# Altium project PCB_Project1.PrjPCB
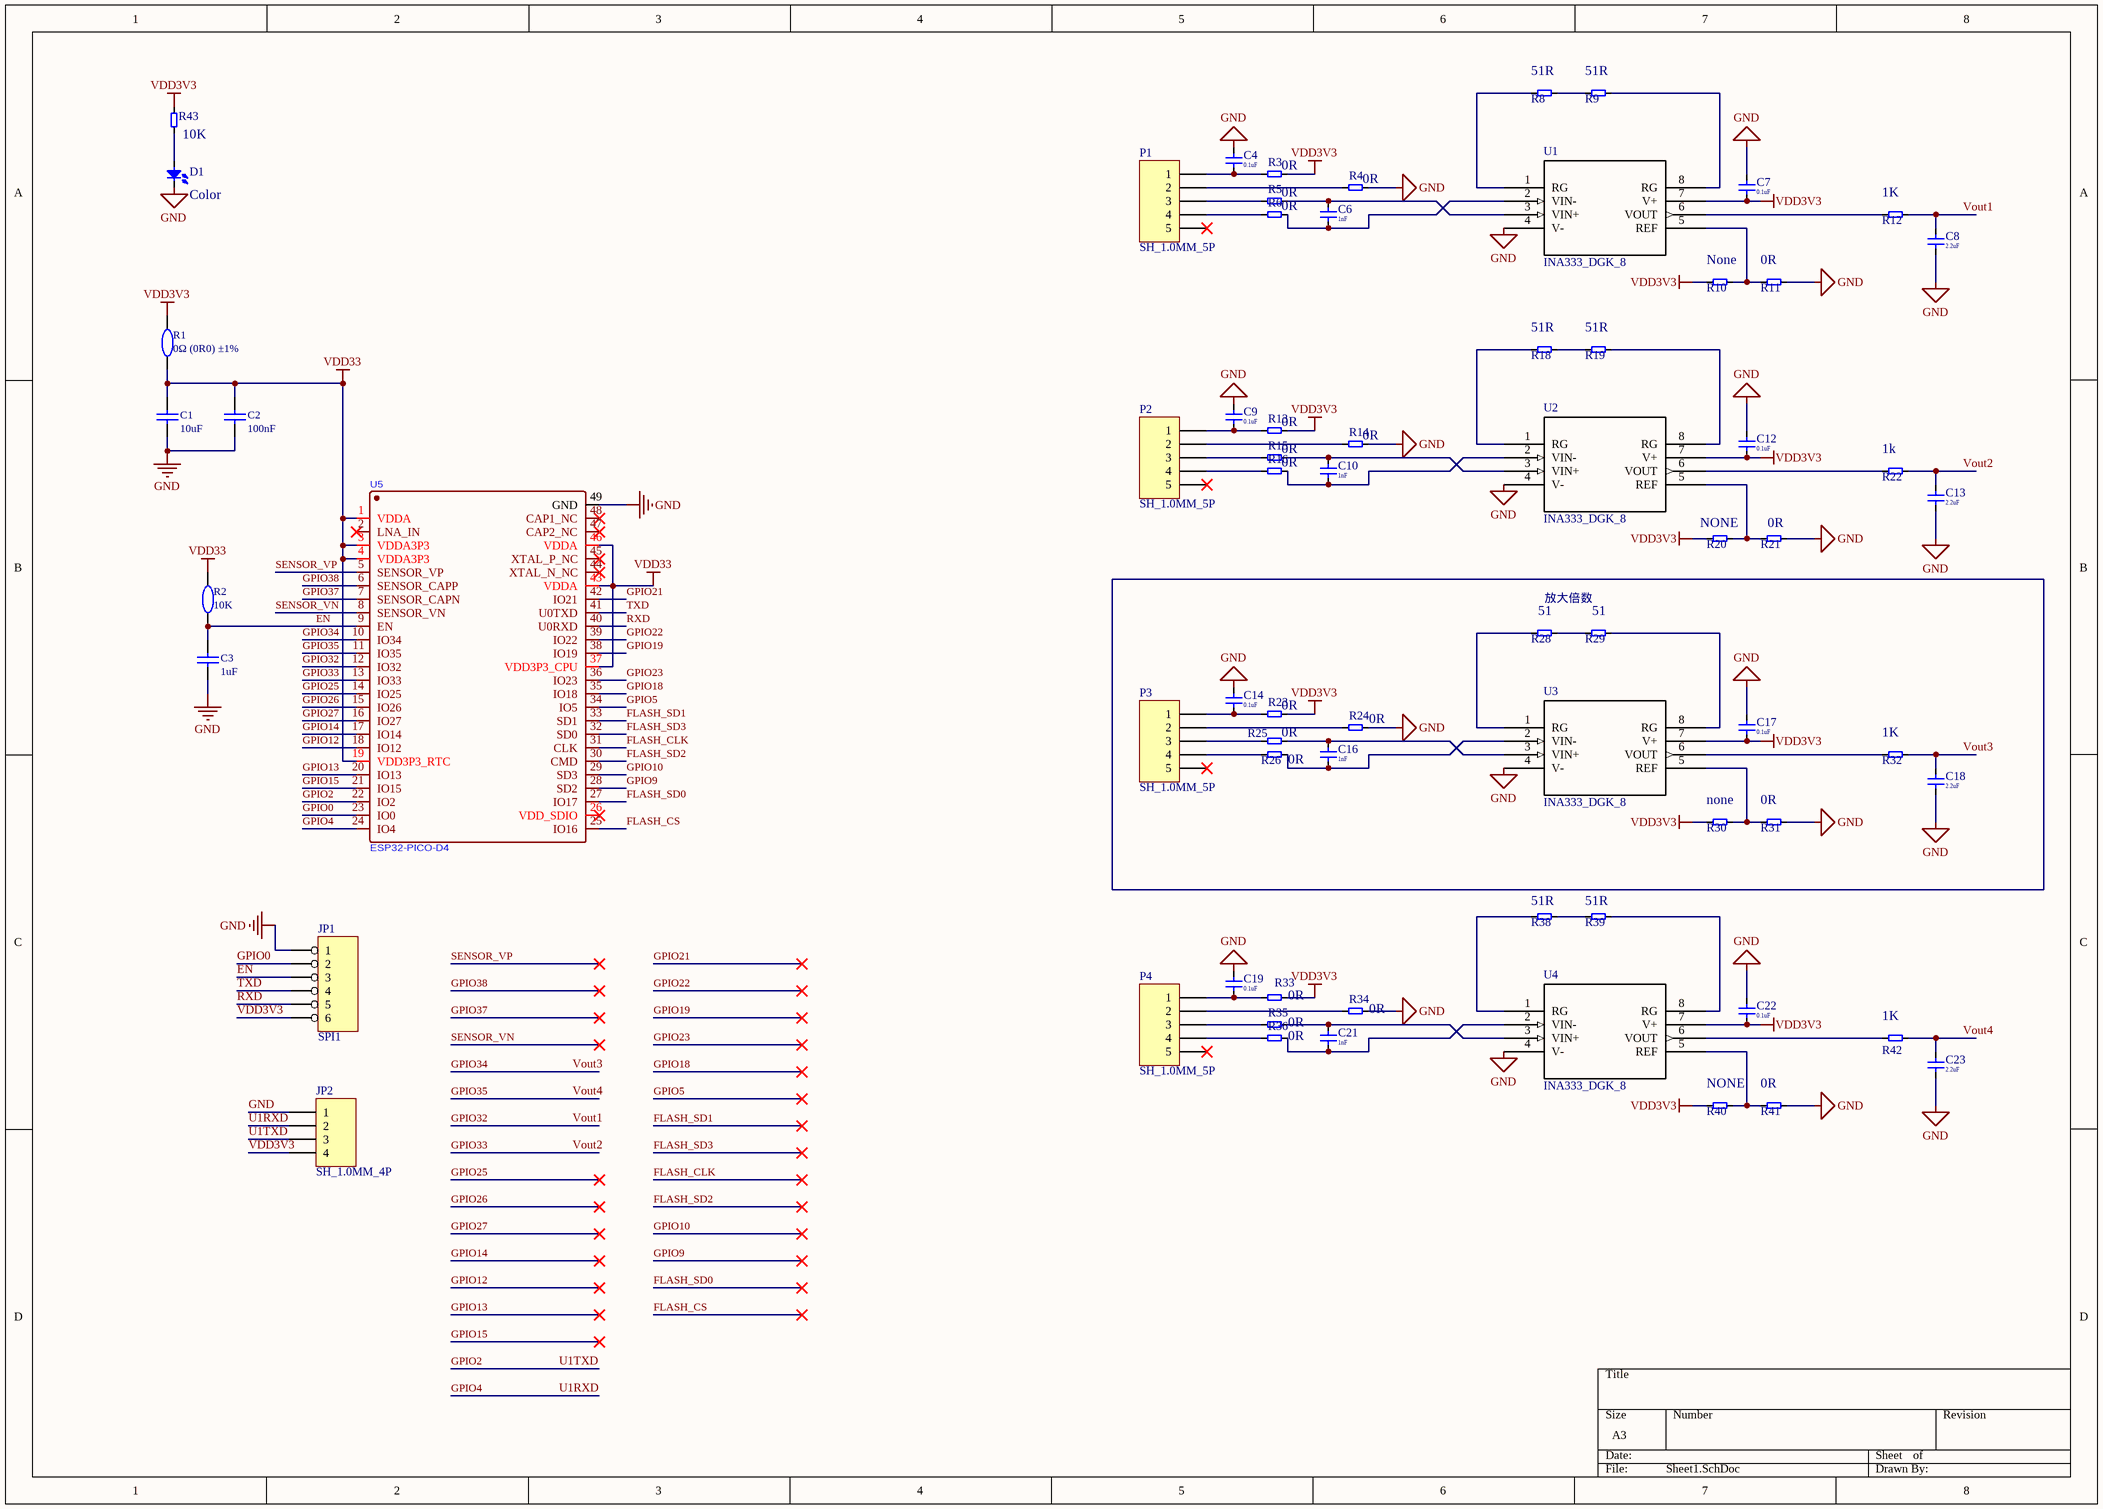
[diagram p0: Sheet1.SchDoc]
1 sheet, 70 parts. Net scope: global (net labels, ports and power ports of the same name join across sheets).
Board file: PCB1.PcbDoc

## Sheet Sheet1.SchDoc
size A3

### Parts
C1  10uF  [0603C]
C2  100nF  [0603C]
C3  1uF  [0603C]
C4  value 0.1uF  [0603C]  (hidden comment: Cb)
C6  value 1nF  [0603C]  (hidden comment: Cb)
C7  value 0.1uF  [0603C]  (hidden comment: Cb)
C8  value 2.2uF  [0603C]  (hidden comment: Cb)
C9  value 0.1uF  [0603C]  (hidden comment: Cb)
C10  value 1nF  [0603C]  (hidden comment: Cb)
C12  value 0.1uF  [0603C]  (hidden comment: Cb)
C13  value 2.2uF  [0603C]  (hidden comment: Cb)
C14  value 0.1uF  [0603C]  (hidden comment: Cb)
C16  value 1nF  [0603C]  (hidden comment: Cb)
C17  value 0.1uF  [0603C]  (hidden comment: Cb)
C18  value 2.2uF  [0603C]  (hidden comment: Cb)
C19  value 0.1uF  [0603C]  (hidden comment: Cb)
C21  value 1nF  [0603C]  (hidden comment: Cb)
C22  value 0.1uF  [0603C]  (hidden comment: 0.1μF)
C23  value 2.2uF  [0603C]  (hidden comment: 2.2μF)
D1  value Color  [0603Led]  (hidden comment: LED0603)
JP1  SPI1  [SHDR6]
JP2  SH_1.0MM_4P  [SH_1.0MM_4P]
P1  SH_1.0MM_5P  [SH_1.0MM_5P]
P2  SH_1.0MM_5P  [SH_1.0MM_5P]
P3  SH_1.0MM_5P  [SH_1.0MM_5P]
P4  SH_1.0MM_5P  [SH_1.0MM_5P]
R1  0Ω (0R0) ±1%  [0603R]
R2  10K  [0603R]
R3  value 0R  [0603R]  (hidden comment: Rb)
R4  value 0R  [0603R]  (hidden comment: Rb)
R5  value 0R  [0603R]  (hidden comment: Rb)
R6  value 0R  [0603R]  (hidden comment: Rb)
R8  value 51R  [0603R]  (hidden comment: Rb)
R9  value 51R  [0603R]  (hidden comment: Rb)
R10  value None  [0603R]  (hidden comment: Rb)
R11  value 0R  [0603R]  (hidden comment: Rb)
R12  value 1K  [0603R]  (hidden comment: Rb)
R13  value 0R  [0603R]  (hidden comment: Rb)
R14  value 0R  [0603R]  (hidden comment: Rb)
R15  value 0R  [0603R]  (hidden comment: Rb)
R16  value 0R  [0603R]  (hidden comment: Rb)
R18  value 51R  [0603R]  (hidden comment: Rb)
R19  value 51R  [0603R]  (hidden comment: Rb)
R20  value NONE  [0603R]  (hidden comment: Rb)
R21  value 0R  [0603R]  (hidden comment: Rb)
R22  value 1k  [0603R]  (hidden comment: Rb)
R23  value 0R  [0603R]  (hidden comment: Rb)
R24  value 0R  [0603R]  (hidden comment: Rb)
R25  value 0R  [0603R]  (hidden comment: Rb)
R26  value 0R  [0603R]  (hidden comment: Rb)
R28  value 51  [0603R]  (hidden comment: Rb)
R29  value 51  [0603R]  (hidden comment: Rb)
R30  value none  [0603R]  (hidden comment: Rb)
R31  value 0R  [0603R]  (hidden comment: Rb)
R32  value 1K  [0603R]  (hidden comment: Rb)
R33  value 0R  [0603R]  (hidden comment: Rb)
R34  value 0R  [0603R]  (hidden comment: Rb)
R35  value 0R  [0603R]  (hidden comment: Rb)
R36  value 0R  [0603R]  (hidden comment: Rb)
R38  value 51R  [0603R]  (hidden comment: Rb)
R39  value 51R  [0603R]  (hidden comment: 51)
R40  value NONE  [0603R]  (hidden comment: Rb)
R41  value 0R  [0603R]  (hidden comment: 0Ω)
R42  1K  [0603R]
R43  10K  [0603R]
U1  INA333_DGK_8  [VSSOP-8]
U2  INA333_DGK_8  [VSSOP-8]
U3  INA333_DGK_8  [VSSOP-8]
U4  INA333_DGK_8  [VSSOP-8]
U5  ESP32-PICO-D4  [PICO]

### Blocks framed on the sheet
放大倍数: C14 C16-C18 P3 R23-R26 R28-R32 U3

### Nets
GND: C1.1 C2.1 C3.1 C4.1 C7.2 C8.1 C9.1 C12.2 C13.1 C14.1 C17.2 C18.1 C19.1 C22.2 C23.1 D1.1 JP1.1 JP2.1 R4.1 R11.2 R14.1 R21.2 R24.1 R31.2 R34.1 R41.2 U1.4(V-) U2.4(V-) U3.4(V-) U4.4(V-) U5.49(GND)
VDD3V3: C7.1 C12.1 C17.1 C22.1 JP1.6 JP2.4 R1.2 R3.1 R10.1 R13.1 R20.1 R23.1 R30.1 R33.1 R40.1 R43.1 U1.7(V+) U2.7(V+) U3.7(V+) U4.7(V+)
VDD33: C1.2 C2.2 R1.1 R2.2 U5.1(VDDA) U5.3(VDDA3P3) U5.4(VDDA3P3) U5.19(VDD3P3_RTC) U5.37(VDD3P3_CPU) U5.43(VDDA) U5.46(VDDA)
EN: C3.2 JP1.3 R2.1 U5.9(EN)
FLASH_CLK: U5.31(CLK)
FLASH_CS: U5.25(IO16)
FLASH_SD0: U5.27(IO17)
FLASH_SD1: U5.33(SD1)
FLASH_SD2: U5.30(CMD)
FLASH_SD3: U5.32(SD0)
GPIO0: JP1.2 U5.23(IO0)
GPIO2: JP2.3 U5.22(IO2)  [also labelled U1TXD]
GPIO4: JP2.2 U5.24(IO4)  [also labelled U1RXD]
GPIO5: U5.34(IO5)
GPIO9: U5.28(SD2)
GPIO10: U5.29(SD3)
GPIO12: U5.18(IO12)
GPIO13: U5.20(IO13)
GPIO14: U5.17(IO14)
GPIO15: U5.21(IO15)
GPIO18: U5.35(IO18)
GPIO19: U5.38(IO19)
GPIO21: U5.42(IO21)
GPIO22: U5.39(IO22)
GPIO23: U5.36(IO23)
GPIO25: U5.14(IO25)
GPIO26: U5.15(IO26)
GPIO27: U5.16(IO27)
GPIO32: C8.2 R12.2 U5.12(IO32)  [also labelled Vout1]
GPIO33: C13.2 R22.2 U5.13(IO33)  [also labelled Vout2]
GPIO34: C18.2 R32.2 U5.10(IO34)  [also labelled Vout3]
GPIO35: C23.2 R42.2 U5.11(IO35)  [also labelled Vout4]
GPIO37: U5.7(SENSOR_CAPN)
GPIO38: U5.6(SENSOR_CAPP)
RXD: JP1.5 U5.40(U0RXD)
SENSOR_VN: U5.8(SENSOR_VN)
SENSOR_VP: U5.5(SENSOR_VP)
TXD: JP1.4 U5.41(U0TXD)
NetC4_2: C4.2 P1.1 R3.2
NetC6_1: C6.1 R6.1 U1.2(VIN-)
NetC6_2: C6.2 R5.1 U1.3(VIN+)
NetC9_2: C9.2 P2.1 R13.2
NetC10_1: C10.1 R16.1 U2.2(VIN-)
NetC10_2: C10.2 R15.1 U2.3(VIN+)
NetC14_2: C14.2 P3.1 R23.2
NetC16_1: C16.1 R26.1 U3.2(VIN-)
NetC16_2: C16.2 R25.1 U3.3(VIN+)
NetC19_2: C19.2 P4.1 R33.2
NetC21_1: C21.1 R36.1 U4.2(VIN-)
NetC21_2: C21.2 R35.1 U4.3(VIN+)
NetD1_2: D1.2 R43.2
NetP1_2: P1.2 R4.2
NetP1_3: P1.3 R5.2
NetP1_4: P1.4 R6.2
NetP2_2: P2.2 R14.2
NetP2_3: P2.3 R15.2
NetP2_4: P2.4 R16.2
NetP3_2: P3.2 R24.2
NetP3_3: P3.3 R25.2
NetP3_4: P3.4 R26.2
NetP4_2: P4.2 R34.2
NetP4_3: P4.3 R35.2
NetP4_4: P4.4 R36.2
NetR8_1: R8.1 U1.1(RG)
NetR8_2: R8.2 R9.1
NetR9_2: R9.2 U1.8(RG)
NetR10_2: R10.2 R11.1 U1.5(REF)
NetR12_1: R12.1 U1.6(VOUT)
NetR18_1: R18.1 U2.1(RG)
NetR18_2: R18.2 R19.1
NetR19_2: R19.2 U2.8(RG)
NetR20_2: R20.2 R21.1 U2.5(REF)
NetR22_1: R22.1 U2.6(VOUT)
NetR28_1: R28.1 U3.1(RG)
NetR28_2: R28.2 R29.1
NetR29_2: R29.2 U3.8(RG)
NetR30_2: R30.2 R31.1 U3.5(REF)
NetR32_1: R32.1 U3.6(VOUT)
NetR38_1: R38.1 U4.1(RG)
NetR38_2: R38.2 R39.1
NetR39_2: R39.2 U4.8(RG)
NetR40_2: R40.2 R41.1 U4.5(REF)
NetR42_1: R42.1 U4.6(VOUT)

Not connected (* = marked no-connect by the designer): P1 5*; P2 5*; P3 5*; P4 5*; U5 2(LNA_IN)* 26(VDD_SDIO)* 44(XTAL_N_NC)* 45(XTAL_P_NC)* 47(CAP2_NC)* 48(CAP1_NC)*

### Library data of the parts
C4 C6-C10 C12-C14 C16-C19 C21-C23 = Cap0603
JP1 = HEADER 6
R3-R6 R8-R16 R18-R26 R28-R36 R38-R43 = Res0603
  R42: Value: 1K
  R43: Value: 10K
U1-U4 = INA333_DGK_8: Imported; Manufacturer: Texas Instruments; GENERIC_PART_NUMBER: INA333; INDUSTRY_STD_PKG_TYPE: MSOP; FAMILY_NAME: SINGLE SUPPLY; PIN_COUNT: 8; PACKAGE_DESIGNATOR: DGK; Datasheet URL: http://www.ti.com/lit/gpn/INA333; Vendor: Texas Instruments; Manufacturer_Part_Number: ina333_dgk_8; RefDes: RefDes; Type: DEV; Value: Value
C1 = 10uF: ComponentLink1Description: 供应商链接; ComponentLink1URL: http://www.szlcsc.com/product/details_20411.html; Supplier: LC; SuppliersPartNumber: C19702
C2 = 100nF: ComponentLink1Description: 供应商链接; ComponentLink1URL: http://www.szlcsc.com/product/details_15331.html; Supplier: LC; SuppliersPartNumber: C14663
C3 = 1uF: ComponentLink1Description: 供应商链接; ComponentLink1URL: http://www.szlcsc.com/product/details_16531.html; Supplier: LC; SuppliersPartNumber: C15849
JP2 = SH_1.0MM_4P: LatestRevisionDate: 17-Jul-2002; LatestRevisionNote: Re-released for DXP Platform.; Publisher: Altium Limited
P1-P4 = SH_1.0MM_5P: LatestRevisionDate: 17-Jul-2002; LatestRevisionNote: Re-released for DXP Platform.; Publisher: Altium Limited
R1 = 0Ω (0R0) ±1%: ComponentLink1Description: 供应商链接; ComponentLink1URL: http://www.szlcsc.com/product/details_21903.html; Supplier: LC; SuppliersPartNumber: C21189
R2 = 10K: ComponentLink1Description: 供应商链接; ComponentLink1URL: http://www.szlcsc.com/product/details_26547.html; Supplier: LC; SuppliersPartNumber: C25804